# EAGLE design esp32 (EAGLE 8.4.3)
CNAME: Simulacare; CREVISION: 1.0.2; DESIGNER: Rinaldo; UNTITLED: Board ESP32
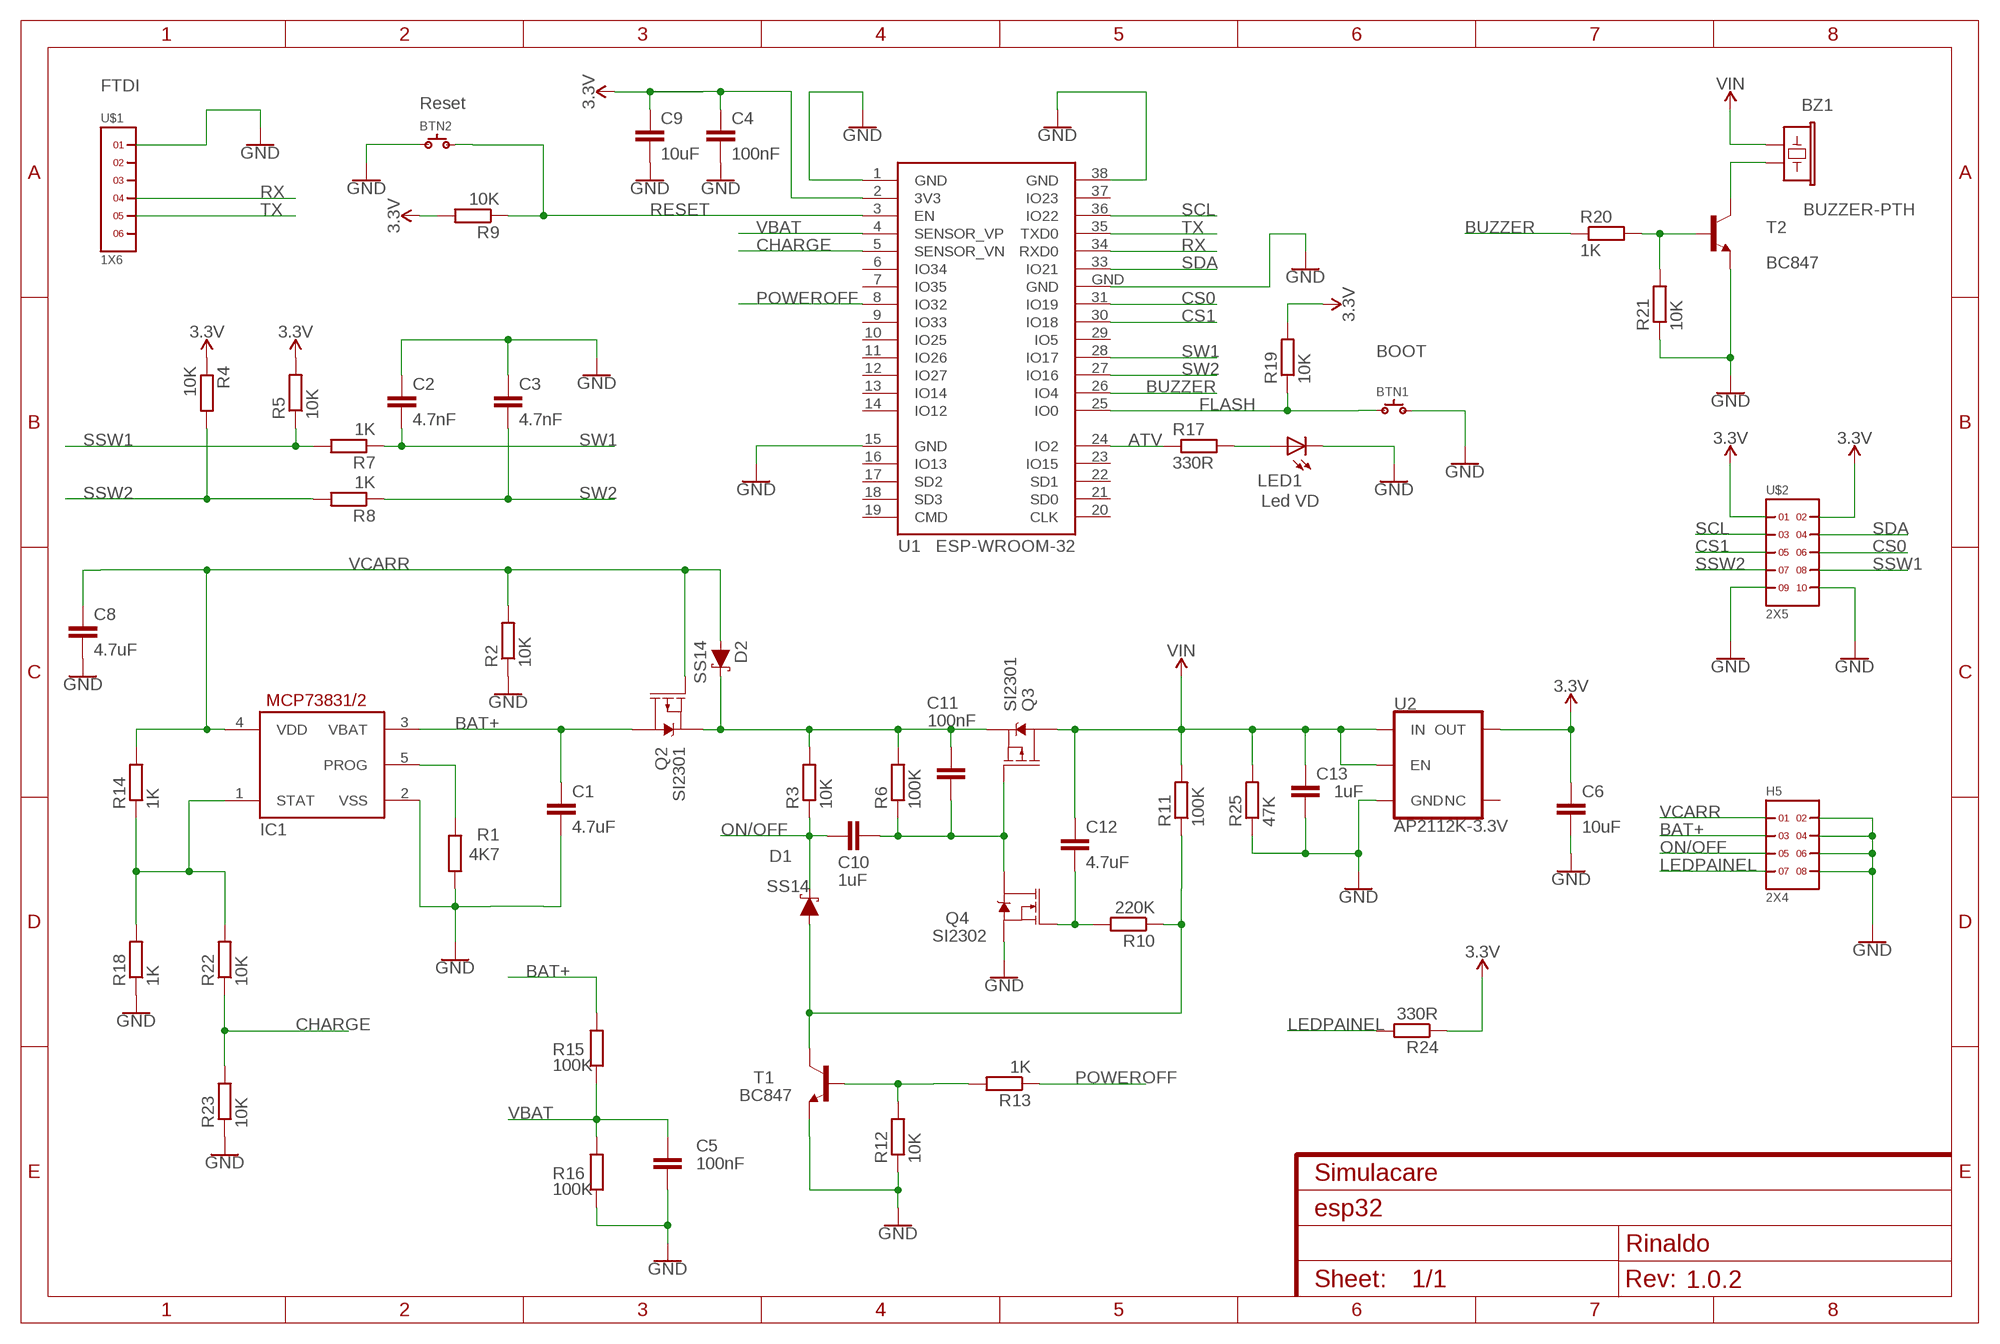
[diagram p0: schematic, sheet 1]

## Parts
BTN1  SPST.B3U-1000P(M)  [B3U-1000P(M)]
BTN2  SPST.B3U-1000P(M)  [B3U-1000P(M)]
BZ1  BUZZER-PTH  [BUZZER-12MM]
C1  4.7uF  C-EUC0603  [C0603]
C2  4.7nF  C-EUC0603  [C0603]
C3  4.7nF  C-EUC0603  [C0603]
C4  100nF  C-EUC0603  [C0603]
C5  100nF  C-EUC0603  [C0603]
C6  10uF  C-EUC0603  [C0603]
C8  4.7uF  C-EUC0603  [C0603]
C9  10uF  C-EUC0603  [C0603]
C10  1uF  C-EUC0603  [C0603]
C11  100nF  C-EUC0603  [C0603]
C12  4.7uF  C-EUC0603  [C0603]
C13  1uF  C-EUC0603  [C0603]
D1  SS14  DIODE-SCHOTTKY-SS14  [SMA-DIODE]
D2  SS14  DIODE-SCHOTTKY-SS14  [SMA-DIODE]
H5  2X4  [2X4]
IC1  MCP73831/OT  [SOT23-5L]
LED1  Led VD  LEDCHIP-LED0603  [CHIP-LED0603]
Q2  SI2301  MOSFET_PCH-SI2309DS  [SOT23-3]
Q3  SI2301  MOSFET_PCH-SI2309DS  [SOT23-3]
Q4  SI2302  MOSFET-NCH-AO3404A  [SOT23-3]
R1  4K7  R-EU_R0603  [R0603]
R2  10K  R-EU_R0603  [R0603]
R3  10K  R-EU_R0603  [R0603]
R4  10K  R-EU_R0603  [R0603]
R5  10K  R-EU_R0603  [R0603]
R6  100K  R-EU_R0603  [R0603]
R7  1K  R-EU_R0603  [R0603]
R8  1K  R-EU_R0603  [R0603]
R9  10K  R-EU_R0603  [R0603]
R10  220K  R-EU_R0603  [R0603]
R11  100K  R-EU_R0603  [R0603]
R12  10K  R-EU_R0603  [R0603]
R13  1K  R-EU_R0603  [R0603]
R14  1K  R-EU_R0603  [R0603]
R15  100K  R-EU_R0603  [R0603]
R16  100K  R-EU_R0603  [R0603]
R17  330R  R-EU_R0603  [R0603]
R18  1K  R-EU_R0603  [R0603]
R19  10K  R-EU_R0603  [R0603]
R20  1K  R-EU_R0603  [R0603]
R21  10K  R-EU_R0603  [R0603]
R22  10K  R-EU_R0603  [R0603]
R23  10K  R-EU_R0603  [R0603]
R24  330R  R-EU_R0603  [R0603]
R25  47K  R-EU_R0603  [R0603]
T1  BC847  [SOT23]
T2  BC847  [SOT23]
U1  ESP-WROOM-32  [ESP-WROOM-32]
U2  AP2112K-3.3V  V_REG_AP2112K-3.3V  [SOT23-5]
U$1  1X6  [1X6]
U$2  2X5  [2X5]

## Nets
3.3V: C4.1 C6.1 C9.1 R4.1 R5.2 R9.2 R19.2 R24.1 U1.2(3V3) U2.5(OUT) U$2.1 U$2.2
ATV: R17.1 U1.24(IO2)
BAT+: C1.1 H5.3 IC1.3(VBAT) Q2.3(D) R15.2
BUZZER: R20.1 U1.26(IO4)
CHARGE: R22.1 R23.2 U1.5(SENSOR_VN)
CS0: U1.31(IO19) U$2.6
CS1: U1.30(IO18) U$2.5
FLASH: BTN1.1 R19.1 U1.25(IO0)
GND: BTN1.2 BTN2.1 C1.2 C2.1 C3.1 C4.2 C5.2 C6.2 C8.2 C9.2 C13.2 H5.2 H5.4 H5.6 H5.8 IC1.2(VSS) LED1.C Q4.2(S) R1.1 R2.1 R12.1 R16.1 R18.1 R21.1 R23.1 R25.1 T1.2(E) T2.2(E) U1.1(GND) U1.15(GND) U1.38(GND) U1.GND U2.2(GND) U$1.1 U$2.9 U$2.10
LEDPAINEL: H5.7 R24.2
N$1: C12.2 Q4.1(G) R10.2
N$2: R20.2 R21.2 T2.1(B)
N$3: BZ1.- T2.3(C)
N$4: IC1.1(STAT) R14.1 R18.2 R22.2
N$6: C10.2 C11.1 Q3.1(G) Q4.3(D) R6.1
N$7: R12.2 R13.2 T1.1(B)
N$10: IC1.5(PROG) R1.2
N$15: C11.2 D2.C Q2.2(S) Q3.2(S) R3.2 R6.2
N$21: D1.A R10.1 R11.1 T1.3(C)
N$23: LED1.A R17.2
ON/OFF: C10.1 D1.C H5.5 R3.1
POWEROFF: R13.1 U1.8(IO32)
RESET: BTN2.2 R9.1 U1.3(EN)
RX: U1.34(RXD0) U$1.4
SCL: U1.36(IO22) U$2.3
SDA: U1.33(IO21) U$2.4
SSW1: R5.1 R7.2 U$2.8
SSW2: R4.2 R8.2 U$2.7
SW1: C2.2 R7.1 U1.28(IO17)
SW2: C3.2 R8.1 U1.27(IO16)
TX: U1.35(TXD0) U$1.5
VBAT: C5.1 R15.1 R16.2 U1.4(SENSOR_VP)
VCARR: C8.1 D2.A H5.1 IC1.4(VDD) Q2.1(G) R2.2 R14.2
VIN: BZ1.+ C12.1 C13.1 Q3.3(D) R11.2 R25.2 U2.1(IN) U2.3(EN)
Unconnected: U1.6(IO34) U1.7(IO35) U1.9(IO33) U1.10(IO25) U1.11(IO26) U1.12(IO27) U1.13(IO14) U1.14(IO12) U1.16(IO13) U1.17(SD2) U1.18(SD3) U1.19(CMD) U1.20(CLK) U1.21(SD0) U1.22(SD1) U1.23(IO15) U1.29(IO5) U1.37(IO23) U2.4(NC) U$1.2 U$1.3 U$1.6

## Notes on the sheet
- FTDI
- Reset
- BOOT

## Library data of the parts
BTN1 BTN2 = rinaldo:SPST
BZ1 = SparkFun-Electromechanical:BUZZER: Buzzer Small round buzzers that operate around the audible 2kHz range. You can use these as speakers to create simple music or user interfaces. Variant Overview: PTH - Mini Speaker - PC Mount 12mm 2.048kHz <https://www.sparkfun.com/products/7950> PTH_KIT - Mini Speaker - PC Mount 12mm 2.048kHz <https://www.sparkfun.com/products/7950> KIT simplifies soldering by adding stop mask to one side of the pads. PTH_NO_SILK - Mini Speaker - PC Mount 12mm 2.048kHz <https://www.sparkfun.com/products/7950> No silkscreen indicator of buzzer outline. PTH_KIT_NO_SILK - Mini Speaker - PC Mount 12mm 2.048kHz <https://www.sparkfun.com/products/7950> KIT package w/o silkscreen SMD - Buzzer Audio Magnetic (CCV-084B16) SMD buzzer used on, e.g. the LilyPad Buzzer <https://www.sparkfun.com/products/8463> and RFID USB Reader <https://www.sparkfun.com/products/9963>. SMD_KIT - Buzzer Audio Magnetic (CCV-084B16) SMD Buzzer with elongated pins to make soldering easier. Used on the SparkFun Simon Says - Surface Mount Soldering Kit <https://www.sparkfun.com/products/10935>.; PROD_ID: COMP-08253; SF_SKU: COM-07950
C1-C6 C8-C13 = rcl:C-EU: CAPACITOR, European symbol
D1 D2 = SparkFun-DiscreteSemi:DIODE-SCHOTTKY: Schottky diode A Schottky diode is a semiconductor diode which has a low forward voltage drop and a very fast switching action.; PROD_ID: DIO-08053; VALUE: 1A/40V/500mV
H5 = headers(.1in):2X4
IC1 = adafruit:MCP73831: MCP73831/2 Miniature Single-Cell, Fully Integrated Li-Ion, Li-Polymer Charge Management Controllers. Nice and small simple lipoly charge controller, with adjustable current and status output (LED) http://www.ladyada.net/library/pcb/eaglelibrary.html
LED1 = adafruit:LED: LED OSRAM: - CHIPLED LG R971, LG N971, LY N971, LG Q971, LY Q971, LO R971, LY R971 LH N974, LH R974 LS Q976, LO Q976, LY Q976 LO Q996 - Hyper CHIPLED LW Q18S LB Q993, LB Q99A, LB R99A - SideLED LS A670, LO A670, LY A670, LG A670, LP A670 LB A673, LV A673, LT A673, LW A673 LH A674 LY A675 LS A676, LA A676, LO A676, LY A676, LW A676 LS A679, LY A679, LG A679 - Hyper Micro SIDELED® LS Y876, LA Y876, LO Y876, LY Y876 LT Y87S - SmartLED LW L88C, LW L88S LB L89C, LB L89S, LG L890 LS L89K, LO L89K, LY L89K LS L896, LA L896, LO L896, LY L896 - TOPLED LS T670, LO T670, LY T670, LG T670, LP T670 LSG T670, LSP T670, LSY T670, LOP T670, LYG T670 LG T671, LOG T671, LSG T671 LB T673, LV T673, LT T673, LW T673 LH T674 LS T676, LA T676, LO T676, LY T676, LB T676, LH T676, LSB T676, LW T676 LB T67C, LV T67C, LT T67C, LS T67K, LO T67K, LY T67K, LW E67C LS E67B, LA E67B, LO E67B, LY E67B, LB E67C, LV E67C, LT E67C LW T67C LS T679, LY T679, LG T679 LS T770, LO T770, LY T770, LG T770, LP T770 LB T773, LV T773, LT T773, LW T773 LH T774 LS E675, LA E675, LY E675, LS T675 LS T776, LA T776, LO T776, LY T776, LB T776 LHGB T686 LT T68C, LB T68C - Hyper Mini TOPLED® LB M676 - Mini TOPLED Santana® LG M470 LS M47K, LO M47K, LY M47K Source: http://www.osram.convergy.de/
Q2 Q3 = SparkFun-DiscreteSemi:MOSFET_PCH: P-channel MOSFETs Voltage controlled devices that allow control of high current outputs. SparkFun Products: SparkFun ESP32 Thing <https://www.sparkfun.com/products/13907> SparkFun ESP8266 Thing <https://www.sparkfun.com/products/13231>; PROD_ID: TRANS-08285; VALUE: 1.1A/60V/600mΩ
Q4 = SparkFun-DiscreteSemi:MOSFET-NCH: N-channel MOSFETs Voltage controlled devices that allow control of high current outputs. SparkFun Products: SparkFun OpenScale <https://www.sparkfun.com/products/13261> SparkFun Digital Sandbox <https://www.sparkfun.com/products/12651> SparkFun Monster Moto Shield <https://www.sparkfun.com/products/10182> SparkFun MOSFET Power Controller <https://www.sparkfun.com/products/11214>; PROD_ID: TRANS-12988; VALUE: 5.8A/30V/35mΩ
R1-R3 R6 R10-R14 R18 R22 R23 R25 = rcl:R-EU_: RESISTOR, European symbol
R4 R5 R7-R9 R15-R17 R19-R21 R24 = resistor:R-EU_: RESISTOR, European symbol
T1 T2 = transistor:BC847: NPN TRANSISTOR
U1 = esp32:ESP-WROOM-32: Espressif Systems ESP-WROOM-32
U2 = SparkFun-IC-Power:V_REG_AP2112: AP2112 - 600mA CMOS LDO Regulator w/ Enable The AP2112 is CMOS process low dropout linear regulator with enable function, the regulator delivers a guaranteed 600mA (min.) continuous load current. Features Output Voltage Accuracy: ±1.5% Output Current: 600mA (Min.) Foldback Short Current Protection: 50mA Enable Function to Turn ON/OFF VOUT Low Dropout Voltage (3.3V): 250mV (Typ.) @IOUT=600mA Excellent Load Regulation: 0.2%/A (Typ.) Excellent Line Regulation: 0.02%/V (Typ.) Low Quiescent Current: 55μA (Typ.) Low Standby Current: 0.01μA (Typ.) Low Output Noise: 50μVRMS PSRR: 100Hz -65dB, 1kHz -65dB OTSD Protection Stable with 1.0μF Flexible Cap: Ceramic, Tantalum and Aluminum Electrolytic Operation Temperature Range: -40°C to 85°C ESD: MM 400V, HBM 4000V; PROD_ID: VREG-12457; VALUE: 3.3V
U$1 = headers(2mm)(samtec):1X6
U$2 = headers(2mm)(samtec):2X5

## Board
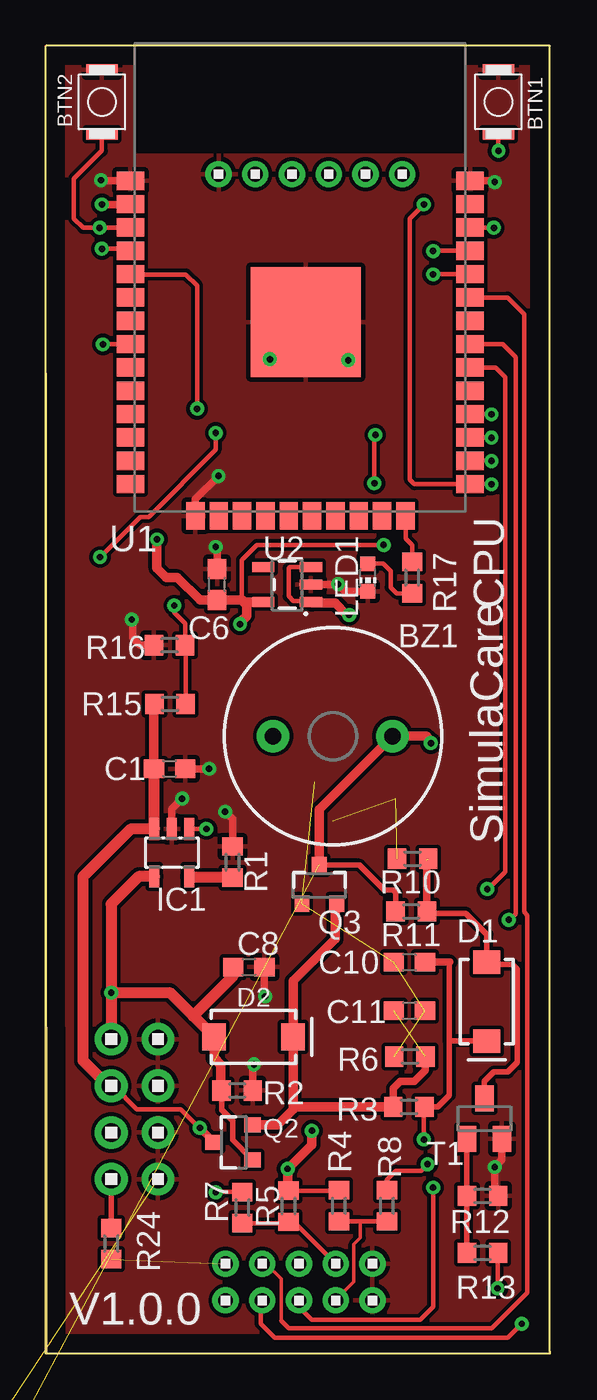
[diagram p1: board, top side]
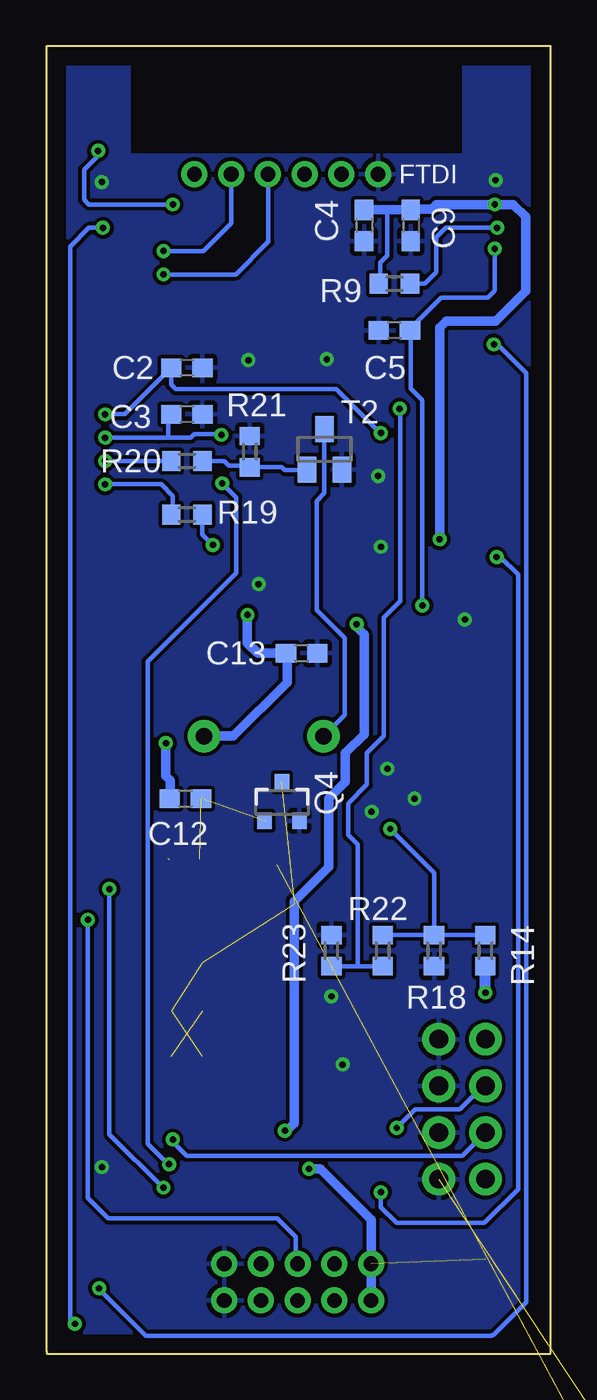
[diagram p2: board, bottom side, seen from below]

Size 27.48 x 71.22 mm. Coordinates in mm from the lower left corner, seen from the top.
Outline: 0.05,0 27.23,0 27.43,0
Outline: 27.43,0 27.46,0 27.43,0.1
Outline: 27.43,0.1 27.48,0.1
Outline: 0,71.22 0.05,0
Outline: 27.43,0.1 27.43,71.22 0,71.22
Outline: 27.43,0.05 27.43,0
Outline: 27.43,0 0.05,0
Outline: 0.05,0 0,0 0,71.22
Copper layers (1*16): Top 0.035mm / dielectric 1.5mm / Bottom 0.035mm
Design rules "default *": minimum track width 8mil, minimum drill 0.35mm, track to track 8mil, track to pad 8mil, pad to pad 8mil, via to via 8mil, smd to smd 8mil, copper to edge 40mil, drill to drill 8mil, minimum pad ring 10mil, minimum via ring 8mil, stop-mask expansion 4mil, vias tented up to drill 0mil, thermal gap 10mil

### Footprints (pad centres in the part's own frame; a part is rotated, then mirrored left to right if it is on the bottom)
B3U-1000P(M) = smd 0.6 x 1.7: 1 -1.75,0; 2 1.75,0
BUZZER-12MM = drill 0.9 pad 1.778: + 3.25,0; - -3.25,0
C0603 = smd 1.1 x 1: 1 -0.85,0; 2 0.85,0
SMA-DIODE = smd 1.27 x 1.47: A -2.15,0; C 2.15,0
2X4 = drill 1.016 pad 1.778: 1 0,0; 2 0,2.54; 3 2.54,0; 4 2.54,2.54; 5 5.08,0; 6 5.08,2.54; 7 7.62,0; 8 7.62,2.54
SOT23-5L = smd 0.55 x 1.2: 1 -0.95,-1.3; 2 0,-1.3; 3 0.95,-1.3; 4 0.95,1.3; 5 -0.95,1.3
CHIP-LED0603 = smd 0.8 x 0.8: A 0,-0.75; C 0,0.75
SOT23-3 = smd 0.8 x 0.9: 1 -0.95,-1; 2 0.95,-1; 3 0,1.1
R0603 = smd 1 x 1.1: 1 -0.85,0; 2 0.85,0
SOT23 = smd 1 x 1.4: 1 -0.95,-1.1; 2 0.95,-1.1; 3 0,1.1
ESP-WROOM-32 = smd 1.5 x 1: 1 -9.25,7; 2 -9.25,5.73; 3 -9.25,4.46; 4 -9.25,3.19; 5 -9.25,1.92; 6 -9.25,0.65; 7 -9.25,-0.62; 8 -9.25,-1.89; 9 -9.25,-3.16; 10 -9.25,-4.43; 11 -9.25,-5.7; 12 -9.25,-6.97; 13 -9.25,-8.24; 14 -9.25,-9.51; 25 9.25,-9.51; 26 9.25,-8.24; 27 9.25,-6.97; 28 9.25,-5.7; 29 9.25,-4.43; 30 9.25,-3.16; 31 9.25,-1.89; 32 9.25,-0.62; 33 9.25,0.65; 34 9.25,1.92; 35 9.25,3.19; 36 9.25,4.46; 37 9.25,5.73; 38 9.25,7 | smd 1 x 1.5: 15 -5.7,-11.25; 16 -4.43,-11.25; 17 -3.16,-11.25; 18 -1.89,-11.25; 19 -0.62,-11.25; 20 0.65,-11.25; 21 1.92,-11.25; 22 3.19,-11.25; 23 4.46,-11.25; 24 5.73,-11.25 | smd 6 x 6: GND 0.3,-0.7
SOT23-5 = smd 0.55 x 1.2: 1 -0.95,-1.3; 2 0,-1.3; 3 0.95,-1.3; 4 0.95,1.3; 5 -0.95,1.3
1X6 = drill 0.8 pad 1.422: 1 0,0; 2 2,0; 3 4,0; 4 6,0; 5 8,0; 6 10,0
2X5 = drill 0.8 pad 1.422: 1 0,0; 2 0,2; 3 2,0; 4 2,2; 5 4,0; 6 4,2; 7 6,0; 8 6,2; 9 8,0; 10 8,2

### Placement (x,y rotation side)
BTN1  24.64,68.17 90 top
BTN2  3.05,68.17 270 top
BZ1  15.62,33.63 0 top
C1  6.73,31.85 0 top
C2  19.81,53.7 180 bottom
C3  19.81,51.16 180 bottom
C4  10.16,61.44 270 bottom
C5  8.51,55.73 180 bottom
C6  9.32,41.88 90 top
C8  11.05,21.06 0 top
C9  7.62,61.44 270 bottom
C10  19.79,21.31 180 top
C11  19.79,18.67 180 top
C12  19.89,30.23 0 bottom
C13  13.56,38.15 0 bottom
D1  24,19.18 270 top
D2  11.3,17.25 0 top
H5  3.56,17.12 270 top
IC1  6.86,27.28 180 top
LED1  17.53,42.27 180 top
Q2  10.24,11.51 90 top
Q3  14.88,25.5 0 top
Q4  14.63,30.02 0 bottom
R1  10.16,26.77 270 top
R2  10.41,14.33 180 top
R3  19.76,13.44 180 top
R4  15.95,8.05 270 top
R5  13.21,8.03 90 top
R6  19.81,16.18 0 top
R7  10.69,7.95 270 top
R8  18.57,8.05 270 top
R9  8.51,58.27 180 bottom
R10  19.96,26.95 180 top
R11  19.89,24.08 180 top
R12  23.77,8.59 180 top
R13  23.77,5.49 180 top
R14  3.56,21.95 270 bottom
R15  6.76,35.38 180 top
R16  6.73,38.58 0 top
R17  19.94,42.27 270 top
R18  6.35,21.95 90 bottom
R19  19.81,45.69 0 bottom
R20  19.81,48.62 0 bottom
R21  16.38,49.12 270 bottom
R22  9.14,21.95 90 bottom
R23  11.94,21.95 270 bottom
R24  3.56,5.99 90 top
R25  -3.81,-6.76 0 top  (outside the outline)
T1  23.88,12.8 0 top
T2  12.32,49.25 0 bottom
U1  13.84,56.87 0 top
U2  13.13,41.88 90 top
U$1  9.4,64.24 0 top
U$2  9.78,2.9 0 top

### Tracks (layer width: path | path; a pad name or v marks a point on that pad's centre or on a via)
3.3V  (via drill 0.35)  (1 unrouted)
  Top 0.254: R5.2 15.93,8.88 R4.1 | v18.39,44.04 11.48,44.04 10.67,43.23 10.67,41.05 10.68,41.03
  Top 0.406: v3.05,62.59 4.58,62.59 U1.2
  Top 0.508: 9.42,40.93 C6.1 | R5.2 13.16,8.93 v13.16,10.06 14.48,11.38 v14.48,12.14 | C6.1 8.39,41.03 7.16,42.27 6.55,42.27 6.04,42.77 v6.04,44.35 | v10.57,39.73 10.57,39.83 10.92,40.18 10.92,40.79 10.77,40.94 | C6.1 10.68,41.03 10.77,40.94 | 10.77,40.94 11.82,40.94 U2.5
  Bottom 0.254: R19.2 18.96,44.62 v18.39,44.04 | 8.89,62.29 8.89,59.79 9.27,59.41 9.27,58.36 R9.2
  Bottom 0.508: U$2.1 U$2.2 9.78,7.29 12.55,10.06 v13.16,10.06 | 13.21,10.06 v13.16,10.06 | v13.16,10.06 | v10.57,39.73 10.57,39.57 10.16,39.17 10.16,33.73 11.18,32.72 11.18,31.14 12.09,30.23 12.09,26.52 13.97,24.64 13.97,12.55 14.38,12.14 v14.48,12.14 | v6.04,44.35 6.04,55.88 5.69,56.24 3,56.24 1.37,57.86 1.37,61.93 2.03,62.59 v3.05,62.59 6.22,62.59 6.48,62.33 7.58,62.33 C9.1 8.89,62.29 C4.1
ATV
  Top 0.254: U1.24 19.56,45.61 19.58,45.58 19.58,44.4 19.94,44.04 R17.1
BAT+  (via drill 0.35)
  Top 0.254: H5.3 3.58,14.58 | H5.3 3.56,14.48 | H5.3 3.68,14.58 4.95,13.31 7.33,13.31 Q2.3
  Top 0.406: 8.89,11.79 v8.38,12.29
  Top 0.508: C1.1 5.88,35.36 R15.2
  Top 0.61: H5.3 3.4,14.58 2.03,15.95 2.03,25.98 4.65,28.6 5.89,28.6 IC1.3 5.91,31.82 C1.1
  Bottom 0.254: H5.3 3.68,14.58 4.83,13.44 4.95,13.31 7.37,13.31 v8.38,12.29
BUZZER  (via drill 0.35)
  Top 0.254: U1.26 24.24,48.63 v24.26,48.62
  Bottom 0.254: v24.26,48.62 R20.1
CHARGE  (via drill 0.35)
  Top 0.254: v8.23,51.46 8.23,58.17 7.62,58.78 4.61,58.78 U1.5
  Bottom 0.254: R22.1 10.52,21.1 | 10.52,21.1 R23.2 | 10.52,21.1 10.52,27.74 11.02,28.24 11.02,29.97 10.01,30.99 10.01,32.72 9.09,33.63 9.09,40.08 8.18,41 8.18,51.41 v8.23,51.46
CS0  (via drill 0.35)
  Top 0.254: U1.31 24.88,54.98 25.58,54.28 25.58,23.95 25.2,23.57 v25.2,23.62
  Bottom 0.254: v25.2,23.62 25.2,8.48 24.08,7.37 14.88,7.37 13.87,6.35 13.87,4.98 U$2.6
CS1  (via drill 0.35)
  Top 0.254: U1.30 24.5,53.71 25.02,53.19 25.02,26.24 24.03,25.25 v24.03,25.3 | U$2.5 13.78,2.53 14.48,1.83 20.37,1.83 21.08,2.54 v21.08,9.04
  Bottom 0.254: v24.03,25.3 24.03,11.94 21.13,9.04 v21.08,9.04
FLASH  (via drill 0.35)
  Top 0.254: U1.25 24.24,47.36 v24.26,47.35 20.07,47.35 19.81,47.6 19.81,61.82 v20.57,62.59 | BTN1.1 v24.64,65.51
  Bottom 0.254: v24.26,47.35 21.21,47.35 20.57,46.71 20.57,45.78 R19.1 | v20.57,62.59 25.15,62.59 25.4,62.84 25.4,64.49 24.64,65.25 v24.64,65.51 | v24.64,65.51 24.64,65.63 v24.64,65.51
GND  (via drill 0.35)  (1 unrouted)
  Top 0.406: U1.38 24.37,63.87 v24.43,63.8 | U1.1 3.03,63.87 v3,63.91 | U1.15 8.14,46.55 v9.4,47.8 | C6.2 9.32,43.87 v9.25,43.94 | U2.2 15.88,41.88 v15.9,41.91 16.3,41.52 LED1.C | R16.1 5.11,38.58 4.72,38.96 4.72,39.93 v4.67,39.98 | C1.2 v8.89,31.85 | IC1.2 6.86,29.67 v7.42,30.23 | R1.1 10.16,29.11 v9.75,29.51 | C8.2 11.9,19.5 v11.94,19.46 | T1.2 24.83,10.55 v24.43,10.16 24.43,8.77 R12.1 | R2.1 11.26,15.68 v11.33,15.75
  other vias: 12.19,54.15 16.46,54.1
  pour Top: 0.13,71.09 27.56,71.09 27.56,-0.15 0.13,-0.15
  pour Bottom: 0,71.35 27.43,71.35 27.43,28.55 27.43,0.1 0,0.1 0,3.4 0,71.22
LEDPAINEL
  Top 0.305: R24.2 H5.7
N$1  (2 unrouted)
N$2
  Bottom 0.254: R20.2 17.78,48.62 17.53,48.36 16.47,48.36 R21.2 14.64,48.27 14.48,48.11 13.31,48.11 T2.1
N$3
  Bottom 0.254: T2.3 12.32,46.86 12.75,46.43 12.75,40.49 11.23,38.96 11.23,34.77 BZ1.-
N$4  (via drill 0.35)
  Top 0.254: v8.74,28.57 IC1.1
  Bottom 0.254: R14.1 R18.2 | R18.2 R22.2 | R18.2 6.35,26.19 v8.74,28.57
N$6  (4 unrouted)
N$7
  Top 0.305: T1.1 22.86,11.64 | T1.1 | R13.2 R12.2 T1.1 | T1.1
  Top 0.406: T1.1
N$10
  Top 0.61: R1.2 7.87,25.92 IC1.5
N$15  (1 unrouted)
  Top 0.406: R6.2 20.66,15.43 20.07,14.83 19.3,14.83 18.92,14.45 18.92,13.45 R3.2
  Top 0.508: Q2.2 12.61,12.46 13.46,13.31 13.46,13.39 | 13.46,13.39 13.46,17.24 D2.C 13.45,20.29 15.75,22.58 15.75,24.42 Q3.2 | R3.2 13.51,13.44 13.46,13.39
N$21  (1 unrouted)
  Top 0.305: T1.3 23.88,14.83 24.38,15.34 25.15,15.34 25.65,15.85 25.65,20.93 25.4,21.18 24.15,21.18 D1.A 24,22.83 22.86,23.98 20.92,23.98 20.74,24.16
  Top 0.406: R11.1 20.74,24.16 20.74,26.87
N$23
  Top 0.254: LED1.A 18.38,43.02 18.77,42.62 18.77,41.73 19.1,41.4 19.93,41.4 R17.2
ON/OFF  (via drill 0.35)
  Top 0.254: v20.57,11.66 20.57,13.4 R3.1
  Top 0.305: R3.1 21.34,13.44 21.97,14.07 21.97,16.96 | 21.97,16.96 21.97,21.3 21.99,21.33 | D1.C 22.04,17.03 21.97,16.96
  Top 0.406: 21.99,21.33 20.65,21.33 C10.1
  Bottom 0.254: H5.5 4.83,10.77 19.81,10.77 20.57,11.53 v20.57,11.66
POWEROFF  (via drill 0.35)
  Top 0.254: U1.8 3.11,54.98 v3.1,54.97 | v24.59,3.56 24.59,5.45 R13.1
  Bottom 0.254: v3.1,54.97 2.9,54.97 1.32,53.39 1.32,2.79 3.1,1.02 3.15,1.02 3.2,0.97 22.05,0.97 24.59,3.51 v24.59,3.56
RESET  (via drill 0.35)
  Top 0.254: BTN2.2 3.05,65.51 1.52,63.98 1.52,61.82 2.03,61.32 v2.92,61.32 4.58,61.32 U1.3
  Bottom 0.254: R9.1 6.86,58.27 6.22,58.9 6.22,60.81 5.71,61.32 v2.92,61.32
RX  (via drill 0.35)
  Top 0.254: 23.11,58.78 U1.34 21.1,58.79 v21.08,58.78
  Bottom 0.254: v21.08,58.78 17.14,58.78 15.37,60.55 15.37,64.21 U$1.4
SCL  (via drill 0.35)
  Top 0.254: U1.36 24.37,61.33 v24.38,61.32 | v25.91,1.63 25.15,0.86 12.45,0.86 11.68,1.63 11.68,2.8 U$2.3
  Bottom 0.254: v24.38,61.32 25.15,61.32 26.16,60.3 26.16,1.88 v25.91,1.63
SDA
  Top 0.203: U$2.4 11.97,4.9 12.8,4.06 12.8,1.78
  Top 0.254: U1.33 25.13,57.52 26.04,56.62 26.04,24.05 26.21,23.88 26.21,3.3 24.28,1.37 13.21,1.37 12.8,1.78
SSW1
  Top 0.254: R7.2 13.21,7.1 R5.1 13.5,7.18 U$2.8
SSW2
  Top 0.203: U$2.7 15.78,2.93 16.76,3.91 16.76,5.94 17.12,6.3 17.12,7.2
  Top 0.254: R8.2 17.12,7.2 R4.2
SW1  (via drill 0.35)
  Top 0.254: U1.28 24.24,51.17 v24.26,51.16 | R7.1 9.41,8.8 9.4,8.79 v9.25,8.79 | v9.25,50.14 9.25,49.23 5.59,45.57 5.13,45.57 v2.95,43.38
  Bottom 0.254: v24.26,51.16 23.2,51.16 C2.2 20.66,52.77 20.42,52.53 11.68,52.53 9.35,50.19 9.3,50.19 v9.25,50.14 | v9.25,8.79 9.25,7.98 8.38,7.11 3.61,7.11 1.78,8.94 1.78,42.42 2.74,43.38 v2.95,43.38
SW2  (via drill 0.35)
  Top 0.254: U1.27 24.24,49.9 v24.26,49.89 | R8.1 18.57,9.47 19.05,9.96 20.42,9.96 v20.78,10.31 | v17.88,47.4 17.88,49.89 17.93,49.94 v17.93,50.04
  Bottom 0.254: 21.34,49.89 v24.26,49.89 20.73,49.89 | C3.2 20.83,50.99 20.83,49.98 20.73,49.89 | v20.78,10.31 20.83,10.31 21.95,11.43 21.95,37.69 17.12,42.52 17.12,46.63 v17.88,47.4 | 20.73,49.89 19.61,49.89 19.41,50.09 17.98,50.09 v17.93,50.04
TX  (via drill 0.35)
  Top 0.254: U1.35 21.1,60.06 v21.08,60.05
  Bottom 0.254: v21.08,60.05 18.92,60.05 17.4,61.57 U$1.5
VBAT  (via drill 0.35)
  Top 0.254: R15.1 7.61,38.56 R16.2 7.58,39.76 6.99,40.36 v6.99,40.74 | v3.05,60.17 4.48,60.17 U1.4
  Bottom 0.254: v3.05,60.17 3.05,57.89 3.43,57.51 5.97,57.51 7.66,55.82 C5.1 7.62,55.69 7.62,52.55 6.99,51.92 v6.99,40.74
VCARR  (via drill 0.35)
  Top 0.305: R2.2 9.56,13.27 10.16,12.67 10.16,11.63 Q2.1
  Top 0.508: D2.A 9.15,16.09 9.53,15.72 9.53,14.36 R2.2
  Top 0.61: v3.56,19.66 H5.1 | v3.56,19.66 6.74,19.66 8.02,18.38 | 8.02,18.38 D2.A | C8.1 10.2,20.56 8.02,18.38 | IC1.4 5.05,25.98 3.56,24.49 v3.56,19.66
  Bottom 0.61: v3.56,19.66 R14.2
VIN  (via drill 0.35)  (1 unrouted)
  Top 0.254: U2.3 13.27,42.83 13.21,42.77 13.21,41.25 13.46,41 14.37,41 U2.1
  Top 0.305: Q3.3 17.06,26.6 18.41,25.25 18.92,25.25 19.05,25.12 R11.2
  Top 0.508: Q3.3 14.88,29.64 BZ1.+ 20.7,33.63 20.83,33.5 20.83,33.38 v20.95,33.25 | v16.51,40.23 16.38,40.23 15.75,40.87 14.5,40.87 U2.1
  Bottom 0.508: v20.95,33.25 20.95,31.47 20.7,31.22 20.7,30.26 C12.1 | BZ1.+ 17.27,33.63 14.35,36.55 14.35,38.09 C13.1 15.95,38.15 16.51,38.71 v16.51,40.23

### Text on the board
tPlace: CPU | SimulaCare | V1.0.0
bPlace: FTDI